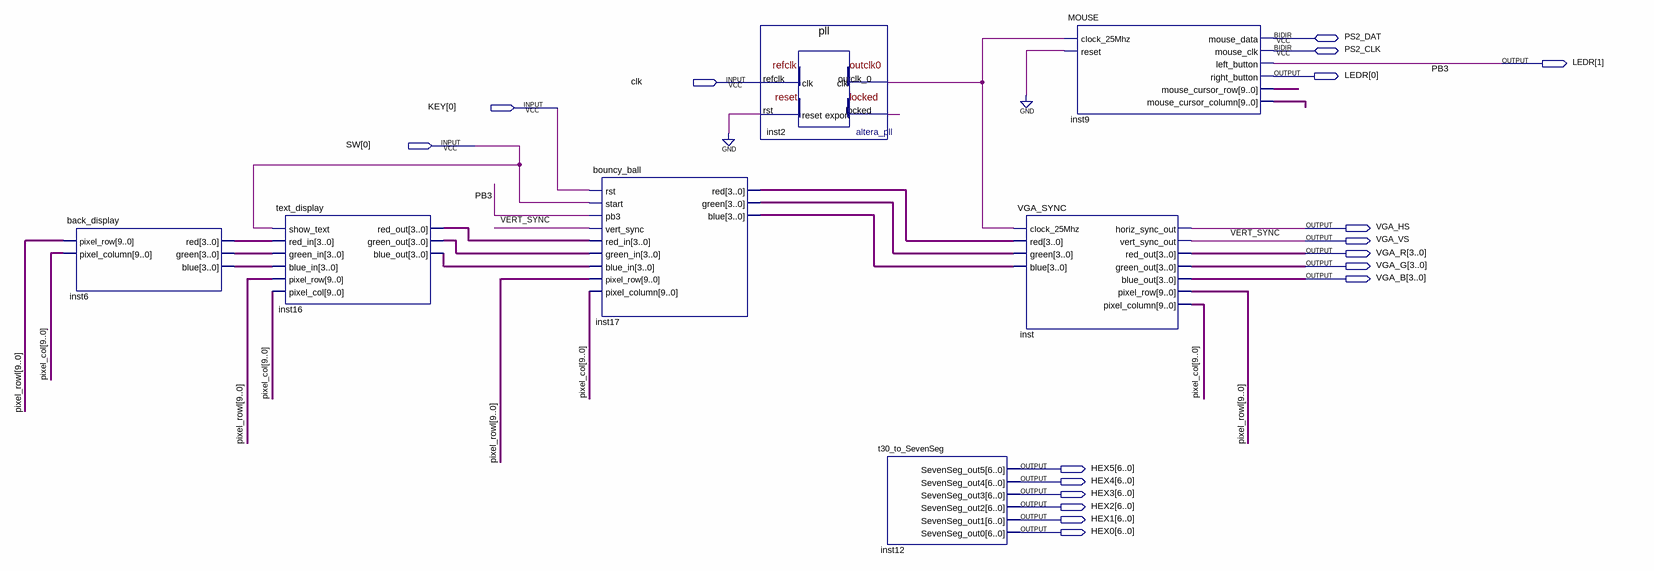
[diagram p0: schematic sheet]
// Quartus schematic interim-demo.bdf as structural Verilog: 7 symbols, 18 pins
module \interim-demo  (
  input  clk,
  input  [0:0] KEY,
  input  [0:0] SW,
  inout  PS2_DAT,
  inout  PS2_CLK,
  output [1:0] LEDR,
  output VGA_HS,
  output VGA_VS,
  output [3:0] VGA_R,
  output [3:0] VGA_G,
  output [3:0] VGA_B,
  output [6:0] HEX5,
  output [6:0] HEX4,
  output [6:0] HEX3,
  output [6:0] HEX2,
  output [6:0] HEX1,
  output [6:0] HEX0
);

  wire inst2_locked, inst2_outclk_0;
  wire [3:0] inst6_blue, inst6_green, inst6_red, inst16_blue_out, inst16_green_out, inst16_red_out,
       inst17_blue, inst17_green, inst17_red;
  wire [9:0] inst9_mouse_cursor_column, inst9_mouse_cursor_row, pixel_col, pixel_rowl;

  back_display inst6 (
    .pixel_row(pixel_rowl), .pixel_column(pixel_col), .red(inst6_red), .green(inst6_green), .blue(inst6_blue));
  text_display inst16 (
    .show_text(SW[0]), .red_in(inst6_red), .green_in(inst6_green), .blue_in(inst6_blue),
    .pixel_row(pixel_rowl), .pixel_col(pixel_col), .red_out(inst16_red_out), .green_out(inst16_green_out),
    .blue_out(inst16_blue_out));
  bouncy_ball inst17 (
    .rst(KEY[0]), .start(SW[0]), .pb3(LEDR[1]), .vert_sync(VGA_VS), .red_in(inst16_red_out),
    .green_in(inst16_green_out), .blue_in(inst16_blue_out), .pixel_row(pixel_rowl), .pixel_column(pixel_col),
    .red(inst17_red), .green(inst17_green), .blue(inst17_blue));
  pll inst2 (.refclk(clk), .rst(1'b0), .outclk_0(inst2_outclk_0), .locked(inst2_locked));
  t30_to_SevenSeg inst12 (
    .SevenSeg_out5(HEX5), .SevenSeg_out4(HEX4), .SevenSeg_out3(HEX3), .SevenSeg_out2(HEX2),
    .SevenSeg_out1(HEX1), .SevenSeg_out0(HEX0));
  VGA_SYNC inst (
    .clock_25Mhz(inst2_outclk_0), .red(inst17_red), .green(inst17_green), .blue(inst17_blue),
    .horiz_sync_out(VGA_HS), .vert_sync_out(VGA_VS), .red_out(VGA_R), .green_out(VGA_G), .blue_out(VGA_B),
    .pixel_row(pixel_rowl), .pixel_column(pixel_col));
  MOUSE inst9 (
    .clock_25Mhz(inst2_outclk_0), .reset(1'b0), .left_button(LEDR[1]), .right_button(LEDR[0]),
    .mouse_cursor_row(inst9_mouse_cursor_row), .mouse_cursor_column(inst9_mouse_cursor_column),
    .mouse_data(PS2_DAT), .mouse_clk(PS2_CLK));

  // Other names for the same wires on the sheet: PB3 = LEDR[1]; VERT_SYNC = VGA_VS
endmodule
